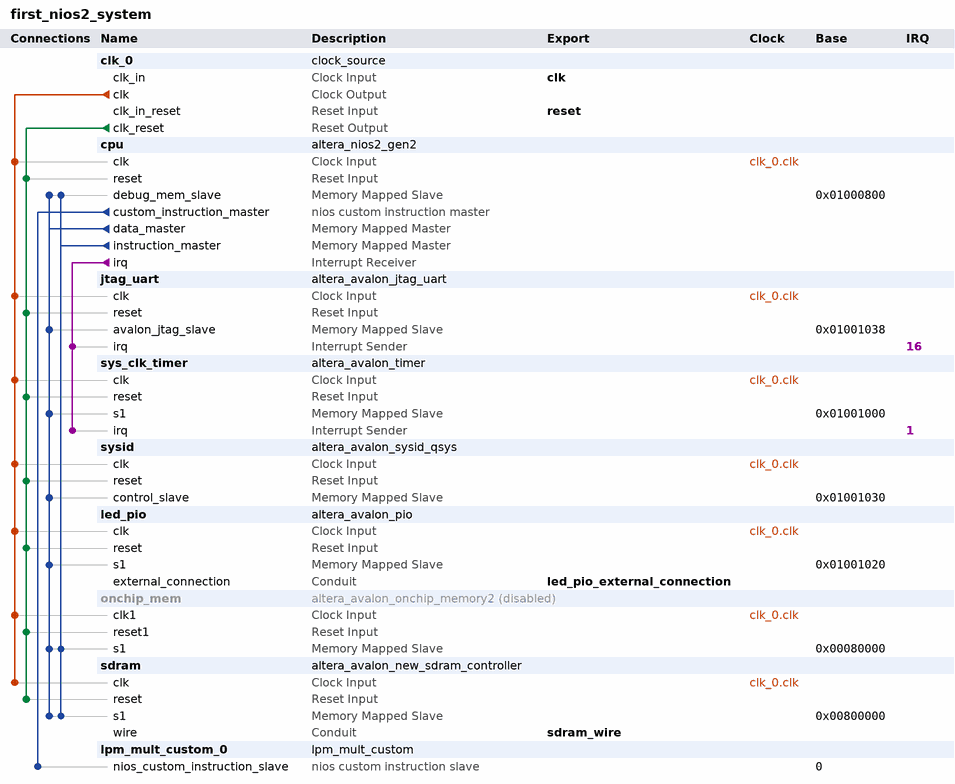
[diagram p0: system contents]
# Platform Designer (Qsys) system first_nios2_system, Cyclone V 5CSEMA5F31C6
# Parameters at their usual value, and those the tool derives, are not listed.
package require -exact qsys 20.1
create_system first_nios2_system
set_project_property DEVICE_FAMILY {Cyclone V}
set_project_property DEVICE 5CSEMA5F31C6

add_instance clk_0 clock_source 20.1
set_instance_parameter_value clk_0 clockFrequency 50000000

add_instance cpu altera_nios2_gen2 20.1
set_instance_parameter_value cpu dcache_size 2048
set_instance_parameter_value cpu exceptionSlave sdram.s1
set_instance_parameter_value cpu icache_size 16384
set_instance_parameter_value cpu impl Fast
set_instance_parameter_value cpu mul_64_impl 1
set_instance_parameter_value cpu mul_shift_choice 1
set_instance_parameter_value cpu resetSlave sdram.s1

add_instance jtag_uart altera_avalon_jtag_uart 20.1
set_instance_parameter_value jtag_uart simInteractiveOptions NO_INTERACTIVE_WINDOWS

add_instance sys_clk_timer altera_avalon_timer 20.1
set_instance_parameter_value sys_clk_timer period 1
set_instance_parameter_value sys_clk_timer periodUnits MSEC

add_instance sysid altera_avalon_sysid_qsys 20.1
set_instance_parameter_value sysid id 0

add_instance led_pio altera_avalon_pio 20.1
set_instance_parameter_value led_pio direction Output
set_instance_parameter_value led_pio width 8

add_instance onchip_mem altera_avalon_onchip_memory2 20.1
set_instance_property onchip_mem ENABLED false
set_instance_parameter_value onchip_mem dataWidth 32
set_instance_parameter_value onchip_mem dualPort false
set_instance_parameter_value onchip_mem initMemContent true
set_instance_parameter_value onchip_mem initializationFileName onchip_mem.hex
set_instance_parameter_value onchip_mem memorySize 393216

add_instance sdram altera_avalon_new_sdram_controller 20.1
set_instance_parameter_value sdram TAC 5.5
set_instance_parameter_value sdram TRCD 20.0
set_instance_parameter_value sdram TRP 20.0
set_instance_parameter_value sdram casLatency 3
set_instance_parameter_value sdram columnWidth 8
set_instance_parameter_value sdram dataWidth 16
set_instance_parameter_value sdram generateSimulationModel false
set_instance_parameter_value sdram model single_Micron_MT48LC4M32B2_7_chip
set_instance_parameter_value sdram numberOfBanks 4
set_instance_parameter_value sdram numberOfChipSelects 1
set_instance_parameter_value sdram powerUpDelay 100.0
set_instance_parameter_value sdram refreshPeriod 15.625
set_instance_parameter_value sdram rowWidth 12

add_instance lpm_mult_custom_0 lpm_mult_custom 1.0

# connections
add_connection clk_0.clk cpu.clk clock
add_connection clk_0.clk jtag_uart.clk clock
add_connection clk_0.clk led_pio.clk clock
add_connection clk_0.clk onchip_mem.clk1 clock
add_connection clk_0.clk sdram.clk clock
add_connection clk_0.clk sys_clk_timer.clk clock
add_connection clk_0.clk sysid.clk clock
add_connection clk_0.clk_reset cpu.reset reset
add_connection clk_0.clk_reset jtag_uart.reset reset
add_connection clk_0.clk_reset led_pio.reset reset
add_connection clk_0.clk_reset onchip_mem.reset1 reset
add_connection clk_0.clk_reset sdram.reset reset
add_connection clk_0.clk_reset sys_clk_timer.reset reset
add_connection clk_0.clk_reset sysid.reset reset
add_connection cpu.data_master cpu.debug_mem_slave avalon
set_connection_parameter_value cpu.data_master/cpu.debug_mem_slave baseAddress 0x01000800
add_connection cpu.data_master jtag_uart.avalon_jtag_slave avalon
set_connection_parameter_value cpu.data_master/jtag_uart.avalon_jtag_slave baseAddress 0x01001038
add_connection cpu.data_master led_pio.s1 avalon
set_connection_parameter_value cpu.data_master/led_pio.s1 baseAddress 0x01001020
add_connection cpu.data_master onchip_mem.s1 avalon
set_connection_parameter_value cpu.data_master/onchip_mem.s1 baseAddress 0x00080000
add_connection cpu.data_master sdram.s1 avalon
set_connection_parameter_value cpu.data_master/sdram.s1 baseAddress 0x00800000
add_connection cpu.data_master sys_clk_timer.s1 avalon
set_connection_parameter_value cpu.data_master/sys_clk_timer.s1 baseAddress 0x01001000
add_connection cpu.data_master sysid.control_slave avalon
set_connection_parameter_value cpu.data_master/sysid.control_slave baseAddress 0x01001030
add_connection cpu.instruction_master cpu.debug_mem_slave avalon
set_connection_parameter_value cpu.instruction_master/cpu.debug_mem_slave baseAddress 0x01000800
add_connection cpu.instruction_master onchip_mem.s1 avalon
set_connection_parameter_value cpu.instruction_master/onchip_mem.s1 baseAddress 0x00080000
add_connection cpu.instruction_master sdram.s1 avalon
set_connection_parameter_value cpu.instruction_master/sdram.s1 baseAddress 0x00800000
add_connection cpu.irq jtag_uart.irq interrupt
set_connection_parameter_value cpu.irq/jtag_uart.irq irqNumber 16
add_connection cpu.irq sys_clk_timer.irq interrupt
set_connection_parameter_value cpu.irq/sys_clk_timer.irq irqNumber 1
add_connection cpu.custom_instruction_master lpm_mult_custom_0.nios_custom_instruction_slave nios_custom_instruction
set_connection_parameter_value cpu.custom_instruction_master/lpm_mult_custom_0.nios_custom_instruction_slave CIName lpm_mult_custom_0
set_connection_parameter_value cpu.custom_instruction_master/lpm_mult_custom_0.nios_custom_instruction_slave baseAddress 0

# exported interfaces
add_interface clk clock sink
set_interface_property clk EXPORT_OF clk_0.clk_in
add_interface led_pio_external_connection conduit end
set_interface_property led_pio_external_connection EXPORT_OF led_pio.external_connection
add_interface reset reset sink
set_interface_property reset EXPORT_OF clk_0.clk_in_reset
add_interface sdram_wire conduit end
set_interface_property sdram_wire EXPORT_OF sdram.wire

set_interconnect_requirement {$system} qsys_mm.clockCrossingAdapter HANDSHAKE
set_interconnect_requirement {$system} qsys_mm.enableEccProtection FALSE
set_interconnect_requirement {$system} qsys_mm.insertDefaultSlave FALSE
set_interconnect_requirement {$system} qsys_mm.maxAdditionalLatency 1

save_system first_nios2_system.qsys
